# EasyEDA Pro project WS2811-40mm_2024-06-16.epro

# Schematic Schematic1
Create Date: 2024-06-16; Page Name: P1; Project Name: RGB40MM; Schematic Name: Schematic1; Update Date: 2024-06-16; Company: 嘉立创EDA; Page Size: A4; Version: V1.0
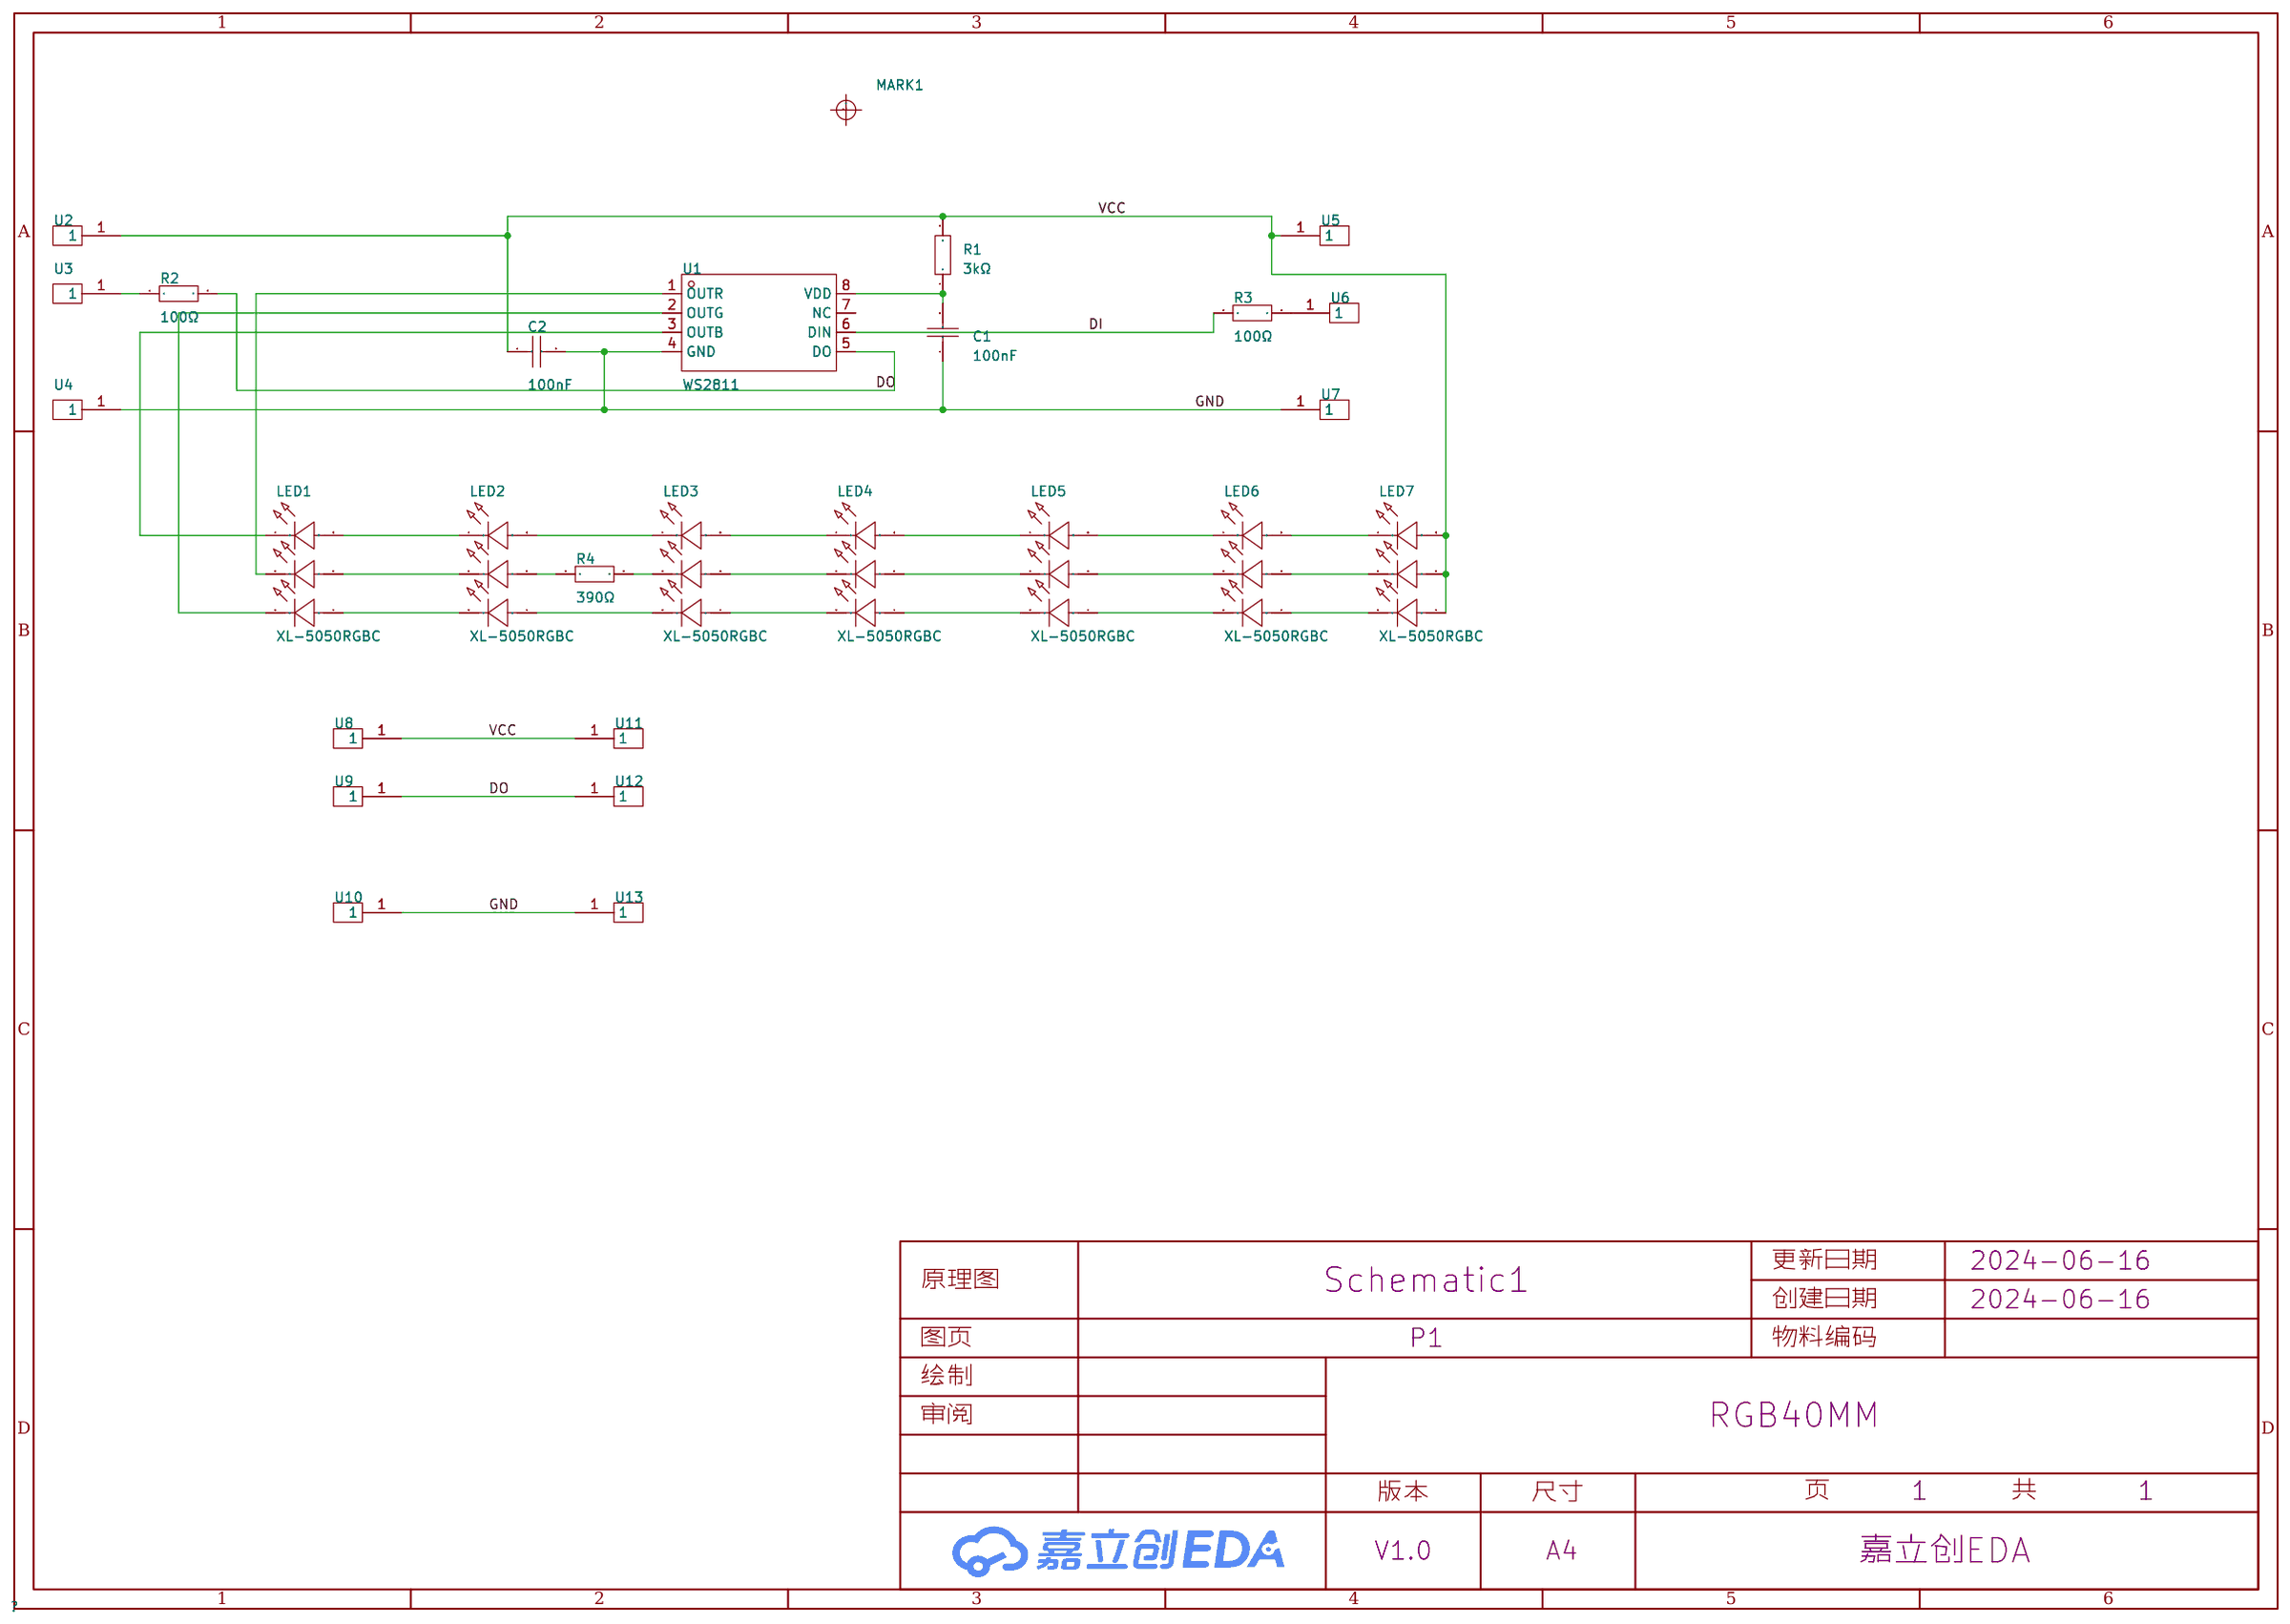
[diagram p0: schematic sheet]

## Parts
C1  100nF  [C0805]
C2  100nF  [C0805]
LED1  XL-5050RGBC  [LED-ARRAY-SMD_6P-L5.0-W5.0-TL-RD_3]
LED2  XL-5050RGBC  [LED-ARRAY-SMD_6P-L5.0-W5.0-TL-RD_3]
LED3  XL-5050RGBC  [LED-ARRAY-SMD_6P-L5.0-W5.0-TL-RD_3]
LED4  XL-5050RGBC  [LED-ARRAY-SMD_6P-L5.0-W5.0-TL-RD_3]
LED5  XL-5050RGBC  [LED-ARRAY-SMD_6P-L5.0-W5.0-TL-RD_3]
LED6  XL-5050RGBC  [LED-ARRAY-SMD_6P-L5.0-W5.0-TL-RD_3]
LED7  XL-5050RGBC  [LED-ARRAY-SMD_6P-L5.0-W5.0-TL-RD_3]
MARK1  -  [Mark-Point-1mm]  (no BOM)
R1  3kΩ  [R1206]
R2  100Ω  [R1206]
R3  100Ω  [R1206]
R4  390Ω  [R1206]
U1  WS2811  [SOP-8_L4.9-W3.9-P1.27-LS6.0-BL]
U2  -  [1.7X9]
U3  -  [1.7X9]
U4  -  [1.7X9]
U5  -  [1.7X9]
U6  -  [1.7X9]
U7  -  [1.7X9]
U8  -  [1.7X9]
U9  -  [1.7X9]
U10  -  [1.7X9]
U11  -  [1.7X9]
U12  -  [1.7X9]
U13  -  [1.7X9]

## Library data of the parts
C1 C2 = CC0805KRX7R9BB104: 容值:100nF;精度:±10%;额定电压:50V;材质(温度系数):X7R;; LCSC Part Name: 100nF ±10% 50V; Supplier Part: C49678; Manufacturer: YAGEO(国巨); Supplier Footprint: 0805; JLCPCB Part Class: 基础库; Datasheet: https://atta.szlcsc.com/upload/public/pdf/source/20180224/C181747_15194369449651363981.pdf; Supplier: LCSC; Tolerance: ±10%; Voltage Rated: 50V; Temperature Coefficient: X7R
LED1-LED7 = XL-5050RGBC: Supplier Part: C2843868; Manufacturer: XINGLIGHT(成兴光); Supplier Footprint: SMD5050; JLCPCB Part Class: 扩展库; Datasheet: https://atta.szlcsc.com/upload/public/pdf/source/20240218/CABDF70070FCD907AD1288F8B8C45105.pdf; Supplier: LCSC
MARK1 = Mark-Point: Mark点
R1 = 1206W4F3001T5E: 电阻类型:厚膜电阻;阻值:3kΩ;精度:±1%;功率:250mW;最大工作电压:200V;温度系数:±100ppm/℃;; LCSC Part Name: 3kΩ ±1% 250mW 厚膜电阻; Supplier Part: C18012; Manufacturer: UNI-ROYAL(厚声); Supplier Footprint: 1206; JLCPCB Part Class: 扩展库; Datasheet: https://atta.szlcsc.com/upload/public/pdf/source/20200306/C422600_1E6D84923E4A46A82E41ADD87F860B5C.pdf; Supplier: LCSC; Type: 厚膜电阻; Tolerance: ±1%; Power(Watts): 250mW; Overload Voltage (Max): 200V; Temperature Coefficient: ±100ppm/℃; Operating Temperature Range: -55℃~+155℃
R2 R3 = RC1206JR-07100RL: 电阻类型:厚膜电阻;阻值:100Ω;精度:±5%;功率:250mW;最大工作电压:200V;温度系数:±100ppm/℃;; LCSC Part Name: 厚膜电阻 100Ω ±5% 250mW; Supplier Part: C113307; Manufacturer: YAGEO(国巨); Supplier Footprint: 1206; JLCPCB Part Class: 扩展库; Datasheet: https://atta.szlcsc.com/upload/public/pdf/source/20170815/C125758_1502799027253889202.pdf; Supplier: LCSC; Type: 厚膜电阻; Tolerance: ±5%; Power(Watts): 250mW; Overload Voltage (Max): 200V; Temperature Coefficient: ±100ppm/℃; Operating Temperature Range: -55℃~+155℃
R4 = 1206W4J0391T5E: 电阻类型:厚膜电阻;阻值:390Ω;精度:±5%;功率:250mW;最大工作电压:200V;温度系数:±100ppm/℃;; LCSC Part Name: 390Ω ±5% 250mW 厚膜电阻; Supplier Part: C25378; Manufacturer: UNI-ROYAL(厚声); Supplier Footprint: 1206; JLCPCB Part Class: 扩展库; Datasheet: https://atta.szlcsc.com/upload/public/pdf/source/20200306/C422600_1E6D84923E4A46A82E41ADD87F860B5C.pdf; Supplier: LCSC; Type: 厚膜电阻; Tolerance: ±5%; Power(Watts): 250mW; Overload Voltage (Max): 200V; Temperature Coefficient: ±100ppm/℃; Operating Temperature Range: -55℃~+155℃
U1 = WS2811: 类型:-;输入电压:-;开关频率:-;通道数:-;输出电压:-;输出电流:-;调光:-;拓扑结构:-;; Supplier Part: C114581; Manufacturer: worldsemi; Supplier Footprint: SOP-8; JLCPCB Part Class: 扩展库; Datasheet: https://atta.szlcsc.com/upload/public/pdf/source/20180423/C114581_D7EB4F7619FBAA371B1B7B79DFB248AC.pdf; Supplier: LCSC
U2-U13 = 1P1.7X9.5

## Nets
GND: C1.1 C2.2 U1.4(GND) U4.1 U7.1 U10.1 U13.1
VCC: C2.1 LED7.4(G+) LED7.5(R+) LED7.6(B+) R1.2 U2.1 U5.1 U8.1 U11.1
DI: R3.1 U1.6(DIN)
DO: R2.2 U1.5(DO) U9.1 U12.1
$1N813: C1.2 R1.1 U1.8(VDD)
$1N1021: LED6.4(G+) LED7.3(G-)
$1N1031: LED6.5(R+) LED7.2(R-)
$1N1034: LED6.6(B+) LED7.1(B-)
$1N1037: LED5.6(B+) LED6.1(B-)
$1N1040: LED5.5(R+) LED6.2(R-)
$1N1043: LED5.4(G+) LED6.3(G-)
$1N1046: LED4.6(B+) LED5.1(B-)
$1N1049: LED4.5(R+) LED5.2(R-)
$1N1052: LED4.4(G+) LED5.3(G-)
$1N1055: LED3.6(B+) LED4.1(B-)
$1N1058: LED3.5(R+) LED4.2(R-)
$1N1061: LED3.4(G+) LED4.3(G-)
$1N1064: LED2.4(G+) LED3.3(G-)
$1N1070: LED2.6(B+) LED3.1(B-)
$1N1145: R2.1 U3.1
$1N1184: R3.2 U6.1
$1N1276: LED1.1(B-) U1.3(OUTB)
$1N1281: LED1.3(G-) U1.2(OUTG)
$1N1325: LED1.6(B+) LED2.1(B-)
$1N1328: LED1.4(G+) LED2.3(G-)
$1N1447: LED2.5(R+) R4.1
$1N1448: LED3.2(R-) R4.2
$1N1453: LED1.5(R+) LED2.2(R-)
$1N1487: LED1.2(R-) U1.1(OUTR)

Not connected (* = marked no-connect by the designer): MARK1 1; U1 7(NC)

# Board 1进3出
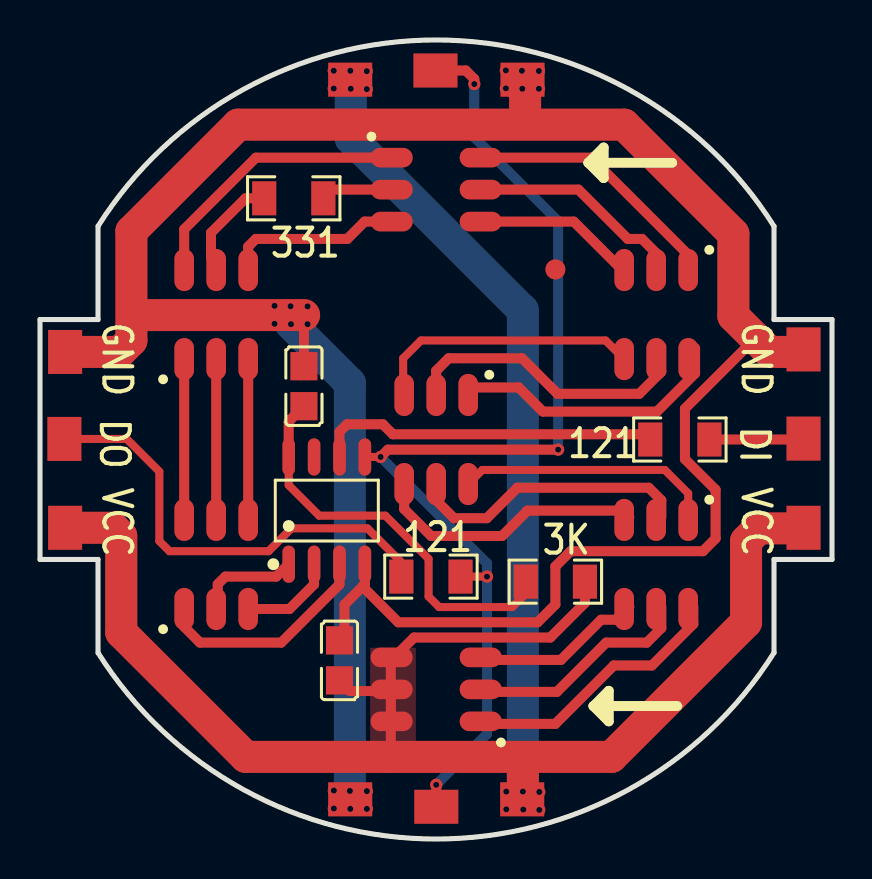
[diagram p1: board, top side]
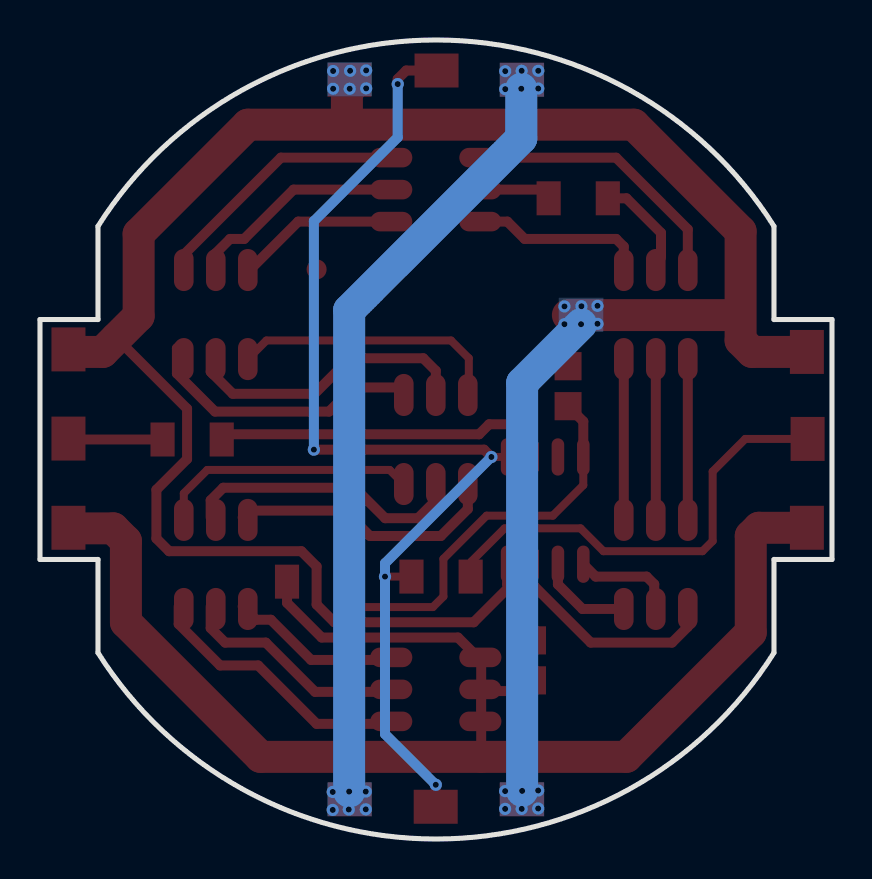
[diagram p2: board, bottom side, seen from below]

Outline 39.6 x 39.97 mm; copper layers: Top Layer, Bottom Layer. Coordinates in mm from the lower left corner of the outline.
Outline path: 0,25.99 2.9,25.99 2.9,30.65 arc(19.8,39.97) 36.7,30.65 36.7,25.99 39.6,25.99 39.6,13.99 36.7,13.99 36.7,9.32 arc(19.8,0) 2.9,9.32 2.9,13.99 0,13.99 0,25.99
Stack: Top Layer 0.035mm / Dielectric1 1.51mm FR4 er 4.5 / Bottom Layer 0.035mm

## Design rules (mm)
template: JLCPCB Capability(Two Layers Board)
spacing copperThickness1oz (default): track to track 0.102, other pairs 0.152 to 0.3
spacing copperThickness2oz: track to track 0.203, other pairs 0.152 to 0.3
track width copperThickness1oz (default): min 0.127, default 0.254, max 2.54
track width copperThickness2oz: min 0.203, default 0.254, max 2.54
differential pair differentialPair (default): width min 0.127, default 0.254, max 2.54; gap min 0.152, default 0.152
via viaSize (default): diameter min 0.5, default 0.61, max 10; hole min 0.3, default 0.305, max 6.3

## Placement (name value [footprint] x y rotation side)
C1  100nF  [C0805]  13.2 22.65 270 top
C2  100nF  [C0805]  14.97 8.94 90 top
LED1  XL-5050RGBC  [LED-ARRAY-SMD_6P-L5.0-W5.0-TL-RD_3]  8.81 13.74 90 top
LED2  XL-5050RGBC  [LED-ARRAY-SMD_6P-L5.0-W5.0-TL-RD_3]  8.81 26.24 90 top
LED3  XL-5050RGBC  [LED-ARRAY-SMD_6P-L5.0-W5.0-TL-RD_3]  19.81 32.49 0 top
LED4  XL-5050RGBC  [LED-ARRAY-SMD_6P-L5.0-W5.0-TL-RD_3]  30.81 26.24 270 top
LED5  XL-5050RGBC  [LED-ARRAY-SMD_6P-L5.0-W5.0-TL-RD_3]  19.81 19.99 270 top
LED6  XL-5050RGBC  [LED-ARRAY-SMD_6P-L5.0-W5.0-TL-RD_3]  30.81 13.74 270 top
LED7  XL-5050RGBC  [LED-ARRAY-SMD_6P-L5.0-W5.0-TL-RD_3]  19.81 7.49 180 top
MARK1  -  [Mark-Point-1mm]  25.77 28.49 0 top
R1  3kΩ  [R1206]  25.77 12.87 0 top
R2  100Ω  [R1206]  19.55 13.13 0 top
R3  100Ω  [R1206]  31.99 19.99 0 top
R4  390Ω  [R1206]  12.69 32.05 0 top
U1  WS2811  [SOP-8_L4.9-W3.9-P1.27-LS6.0-BL]  14.34 16.43 0 top
U2  -  [1.7X9]  38.18 15.57 0 top
U3  -  [1.7X9]  1.22 20.01 0 top
U4  -  [1.7X9]  38.18 24.49 0 top
U5  -  [1.7X9]  1.26 15.57 0 top
U6  -  [1.7X9]  38.18 20.03 0 top
U7  -  [1.7X9]  1.26 24.37 0 top
U8  -  [1.7X9]  15.51 37.99 90 top
U9  -  [1.7X9]  19.77 38.44 90 top
U10  -  [1.7X9]  24.12 37.99 90 top
U11  -  [1.7X9]  24.11 1.99 90 top
U12  -  [1.7X9]  19.81 1.61 90 top
U13  -  [1.7X9]  15.51 1.99 90 top

## Footprints (pads in the part's own frame, mm; a bottom-side part is the same pattern mirrored in y, then rotated)
1.7X9
  rect 1.7x2.2 smd: 1(0,0)
C0805
  rect 1.41x1.35 smd: 1(-1,0) 2(1,0)
LED-ARRAY-SMD_6P-L5.0-W5.0-TL-RD_3
  oval 2.105x0.98 smd: 1(-2.228,1.6) 2(-2.228,0) 3(-2.228,-1.6) 4(2.228,-1.6) 5(2.228,0) 6(2.228,1.6)
Mark-Point-1mm
  round 1 smd: 1(0,0)
R1206
  rect 1.208x1.701 smd: 1(-1.479,0) 2(1.479,0)
SOP-8_L4.9-W3.9-P1.27-LS6.0-BL
  oval 0.63x1.865 smd: 1(-1.905,-2.683) 2(-0.635,-2.683) 3(0.635,-2.683) 4(1.905,-2.683) 5(1.905,2.683) 6(0.635,2.683) 7(-0.635,2.683) 8(-1.905,2.683)

## Nets
As in the schematic.

Pads without a net: MARK1 1; U1 7

## Via types
v1: diameter 0.61, hole 0.305, Top Layer to Bottom Layer, 35 vias

## Routing (per net, layer and track width the routed paths; a pad name or vN(x,y) marks a point on that pad's centre or on a via; arc(x,y) is an arc through that point)
GND: length 126.4
  Top Layer w0.5: 16.13,12.63 17.91,10.84 24.88,10.84 25.77,11.73 25.77,13.64 26.53,14.4 33.14,14.4 33.78,15.03 33.78,17.47 32.25,19 32.25,21.53 35.78,25.06 ; 16.13,12.63 16.24,12.75 U1.4 ; 16.13,12.63 15.23,11.73 15.23,10.19 C2.2 ; v1(13.38,25.75) 13.2,25.57 C1.1
  Top Layer w1.6: 38.18,24.37 36.47,24.37 34.67,26.16 34.67,30.27 29.21,35.73 9.9,35.73 4.57,30.4 4.57,24.94 4,24.37 U7.1 ; v1(24.11,37.53) 24.25,37.39 24.25,35.99 ; 4.82,26.21 13.21,26.21
  Bottom Layer w1.6: v1(12.55,25.75) 15.49,22.81 v1(15.49,2.41)
  vias: v1(11.73,26.67) v1(11.73,25.77) v1(12.53,26.65) v1(13.38,26.64) v1(14.69,2.43) v1(14.69,1.53) v1(15.51,1.51) v1(16.34,2.4) v1(16.34,1.51) v1(23.29,38.45) v1(23.29,37.55) v1(24.09,38.43) v1(24.94,38.42) v1(24.94,37.53)
VCC: length 113.2
  Top Layer w0.4: 17.58,5.76 17.58,7.36
  Top Layer w0.5: 17.54,7.4 17.54,4.11 ; 17.54,7.4 17.54,8.92 18.7,10.08 25.52,10.08 27.25,11.81 R1.2 ; 17.54,7.4 15.51,7.4 C2.1
  Top Layer w1.6: 24.25,3.98 24.14,3.87 v1(24.14,2.37) ; U2.1 38.15,15.54 35.94,15.54 35.3,14.91 35.3,10.84 28.57,4.11 10.28,4.11 4.06,10.33 4.06,15.16 3.65,15.57 U5.1
  Bottom Layer w1.6: v1(15.54,37.53) 15.54,35.05 24.14,26.45 v1(24.14,2.37)
  vias: v1(14.69,38.43) v1(14.69,37.54) v1(15.52,38.43) v1(16.34,38.41) v1(16.34,37.51) v1(23.31,2.37) v1(23.31,1.48) v1(24.16,1.47) v1(24.96,2.35) v1(24.96,1.46)
DI: length 17.3
  Top Layer w0.5: U1.6 14.97,20.37 15.36,20.75 17.14,20.75 17.64,20.25 30.25,20.25 R3.1
DO: length 54.3
  Top Layer w0.4: R2.2 v1(22.35,13.13) ; U1.5 v1(17.03,19.11)
  Top Layer w0.5: v1(21.71,37.77) 21.71,38.02 21.29,38.44 U9.1 ; v1(19.81,2.71) 19.81,2.71 U12.1 ; v1(17.03,19.11) 17.4,19.48 v1(25.91,19.48)
  Bottom Layer w0.5: v1(21.71,37.77) 21.71,35.1 25.91,30.91 v1(25.91,19.48) ; v1(17.03,19.11) 22.35,13.79 v1(22.35,13.13) 22.35,5.25 v1(19.81,2.71)
$1N813: length 20.6
  Top Layer w0.4: U1.8 12.43,17.7 13.96,16.18 17.27,16.18 19.43,14.02 19.43,12.13 19.96,11.6 23.61,11.6 24.12,12.11 24.12,12.7 R1.1
  Top Layer w0.5: U1.8 12.43,20.89 C1.2
$1N1021: length 8.5
  Top Layer w0.5: 29.47,11.63 28.8,10.97 28.06,10.97 26.05,8.96 22.04,8.96
$1N1031: length 11.4
  Top Layer w0.5: 22.04,7.36 25.84,7.36 28.31,9.83 30.34,9.83 31.07,10.55 31.07,11.63
$1N1034: length 13.6
  Top Layer w0.5: 32.67,11.63 32.67,10.75 30.6,8.68 28.69,8.68 25.77,5.76 22.04,5.76
$1N1037: length 13.1
  Top Layer w0.4: LED5.6 22.11,18.46 31.24,18.46 32.41,17.29 LED6.1
$1N1040: length 14.6
  Top Layer w0.5: 31.07,16.09 31.07,16.95 30.44,17.57 23.86,17.57 22.34,16.05 20.7,16.05 19.81,16.94 19.81,18.13
$1N1043: length 14.1
  Top Layer w0.5: 18.21,18.13 18.21,16.51 19.56,15.16 23.1,15.16 24.37,16.43 29.12,16.43 29.47,16.09
$1N1046: length 14
  Top Layer w0.5: 32.67,24.63 32.75,24.54 32.75,23.29 30.85,21.38 25.14,21.38 23.94,22.59 21.41,22.59
$1N1049: length 14.8
  Top Layer w0.5: 31.07,24.63 31.07,23.38 29.96,22.27 25.87,22.27 24.1,24.05 20.44,24.05 19.81,23.42 19.81,22.59
$1N1052: length 13.7
  Top Layer w0.4: LED4.4 28.28,24.94 19.05,24.94 18.16,24.05 18.16,22.26 LED5.3
$1N1055: length 13.2
  Top Layer w0.5: LED4.1 32.41,29.23 27.55,34.09 LED3.6
$1N1058: length 10.9
  Top Layer w0.5: LED4.2 30.81,29.31 30.1,30.02 29.39,30.02 26.92,32.49 LED3.5
$1N1061: length 8.2
  Top Layer w0.5: LED3.4 26.69,30.89 29.11,28.46 LED4.3
$1N1064: length 8.9
  Top Layer w0.5: LED2.4 10.41,29.64 10.79,30.02 15.36,30.02 16.23,30.89 LED3.3
$1N1070: length 13.9
  Top Layer w0.5: LED2.6 7.21,30.5 10.79,34.08 17.58,34.08 LED3.1
$1N1145: length 23.4
  Top Layer w0.4: 18.45,13 18.42,13 18.02,13.4 18.02,13.89 16.37,15.54 12.57,15.54 11.43,14.4 6.47,14.4 5.97,14.91 5.97,18.38 4.34,20.01 U3.1
$1N1184: length 4.7
  Top Layer w0.5: U6.1 38.13,19.99 R3.2
$1N1276: length 11.2
  Top Layer w0.5: U1.3 14.97,12.74 12.06,9.83 8,9.83 7.21,10.61 LED1.1
$1N1281: length 4.8
  Top Layer w0.5: U1.2 13.7,12.74 12.48,11.51 LED1.3
$1N1325: length 8
  Top Layer w0.5: LED1.6 LED2.1
$1N1328: length 8
  Top Layer w0.5: LED2.3 LED1.4
$1N1447: length 4.6
  Top Layer w0.5: 8.55,29.09 8.55,30.32 10.28,32.05 R4.1
$1N1448: length 3.6
  Top Layer w0.5: R4.2 14.6,32.49 LED3.2
$1N1453: length 8
  Top Layer w0.5: LED2.2 LED1.5
$1N1487: length 5.2
  Top Layer w0.5: LED1.2 8.89,11.59 8.89,12.75 9.27,13.13 11.81,13.13 U1.1

## Copper pours and planes (outline as drawn; the poured copper is in the pictures)
GND on Bottom Layer: 23,38.85 25.23,38.85 25.23,37.15 23,37.15
GND on Bottom Layer: 14.39,2.84 16.61,2.84 16.61,1.14 14.39,1.14
GND on Bottom Layer: 11.44,27.08 13.66,27.08 13.66,25.38 11.44,25.38
VCC on Top Layer: 16.51,9.57 18.79,9.57 18.79,4.62 16.51,4.62
VCC on Bottom Layer: 23.01,2.83 25.23,2.83 25.23,1.14 23.01,1.14
VCC on Bottom Layer: 14.4,38.83 16.62,38.83 16.62,37.13 14.4,37.13

## Text on the board
Top Silkscreen Layer: 331 | 121 | 3K | DO | GND | VCC | DI
